# Altium schematic sheet GD32F450_External_Expansion(Camera)_V1.0.SchDoc
size A4
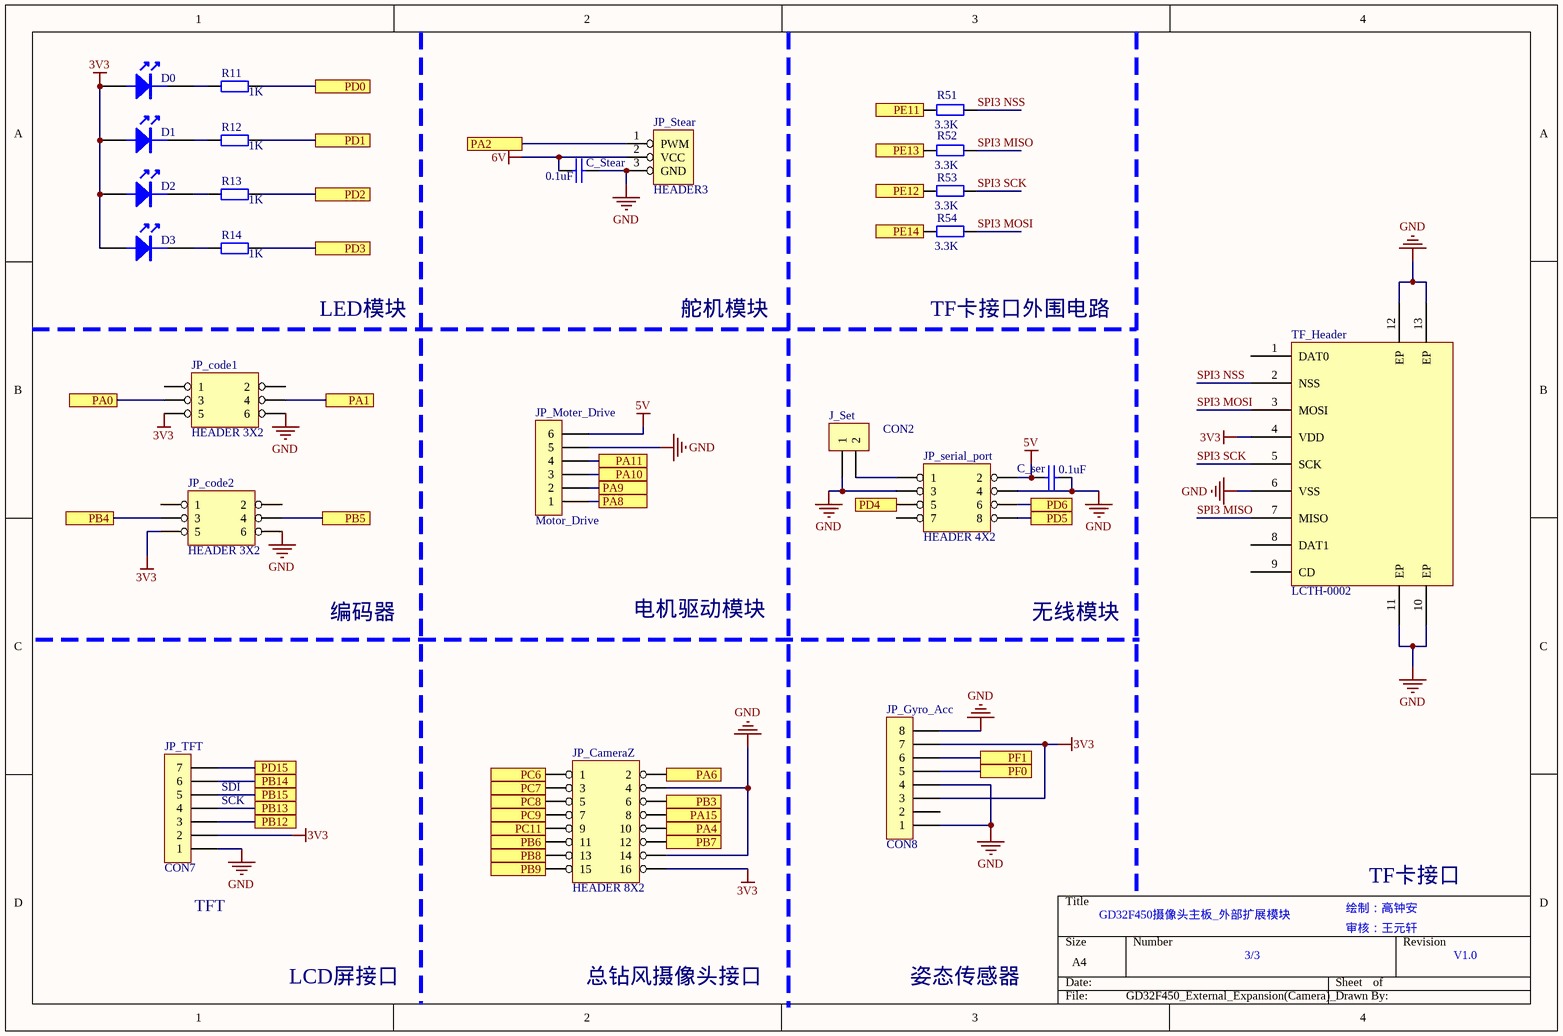
[diagram p0: GD32F450_External_Expansion(Camera)_V1.0.SchDoc]

## Parts
C_ser  0.1uF  [0805C]
C_Stear  0.1uF  [0805C]
D0  LED  [1206LED]  (value not drawn)
D1  LED  [1206LED]  (value not drawn)
D2  LED  [1206LED]  (value not drawn)
D3  LED  [1206LED]  (value not drawn)
J_Set  CON2  [SIP2]
JP_CameraZ  HEADER 8X2  [IDC16-JLC]
JP_code1  HEADER 3X2  [IDC6-JLC]
JP_code2  HEADER 3X2  [IDC6-JLC]
JP_Gyro_Acc  CON8  [SIP8]
JP_Moter_Drive  Motor_Drive  [SIP6N]
JP_serial_port  HEADER 4X2  [IDC8-JLC]
JP_Stear  HEADER3  [SIP3]
JP_TFT  CON7  [SIP7]
R11  value 1K  [0805R]  (hidden comment: Res2)
R12  value 1K  [0805R]  (hidden comment: Res2)
R13  value 1K  [0805R]  (hidden comment: Res2)
R14  value 1K  [0805R]  (hidden comment: Res2)
R51  value 3.3K  [0805R]
R52  value 3.3K  [0805R]
R53  value 3.3K  [0805R]
R54  value 3.3K  [0805R]
TF_Header  LCTH-0002  [TF_2]

## Ports
PA0, PA1, PA2, PA4, PA6, PA8, PA9, PA10, PA11, PA15, PB3, PB4, PB5, PB6, PB7, PB8, PB9, PB12, PB13, PB14, PB15, PC6, PC7, PC8, PC9, PC11, PD0, PD1, PD2, PD3, PD4, PD5, PD6, PD15, PE11, PE12, PE13, PE14, PF0, PF1

## Nets
3V3: D0.A D1.A D2.A D3.A JP_CameraZ.16 JP_code1.5 JP_code2.5 JP_Gyro_Acc.3 JP_Gyro_Acc.7 JP_TFT.2 TF_Header.4(VDD)
5V: C_ser.1 JP_Moter_Drive.6 JP_serial_port.2
6V: C_Stear.1 JP_Stear.2(VCC)
GND: C_ser.2 C_Stear.2 J_Set.1 JP_CameraZ.4 JP_CameraZ.14 JP_code1.6 JP_code2.6 JP_Gyro_Acc.1 JP_Gyro_Acc.4 JP_Gyro_Acc.8 JP_Moter_Drive.5 JP_serial_port.3 JP_serial_port.4 JP_Stear.3(GND) JP_TFT.1 TF_Header.6(VSS) TF_Header.10(EP) TF_Header.11(EP) TF_Header.12(EP) TF_Header.13(EP)
PA0: JP_code1.3 ; port PA0
PA1: JP_code1.4 ; port PA1
PA2: JP_Stear.1(PWM) ; port PA2
PA4: JP_CameraZ.10 ; port PA4
PA6: JP_CameraZ.2 ; port PA6
PA8: JP_Moter_Drive.1 ; port PA8
PA9: JP_Moter_Drive.2 ; port PA9
PA10: JP_Moter_Drive.3 ; port PA10
PA11: JP_Moter_Drive.4 ; port PA11
PA15: JP_CameraZ.8 ; port PA15
PB3: JP_CameraZ.6 ; port PB3
PB4: JP_code2.3 ; port PB4
PB5: JP_code2.4 ; port PB5
PB6: JP_CameraZ.11 ; port PB6
PB7: JP_CameraZ.12 ; port PB7
PB8: JP_CameraZ.13 ; port PB8
PB9: JP_CameraZ.15 ; port PB9
PB12: JP_TFT.3 ; port PB12
PB13: JP_TFT.4 ; port PB13
PB14: JP_TFT.6 ; port PB14
PB15: JP_TFT.5 ; port PB15
PC6: JP_CameraZ.1 ; port PC6
PC7: JP_CameraZ.3 ; port PC7
PC8: JP_CameraZ.5 ; port PC8
PC9: JP_CameraZ.7 ; port PC9
PC11: JP_CameraZ.9 ; port PC11
PD0: R11.2 ; port PD0
PD1: R12.2 ; port PD1
PD2: R13.2 ; port PD2
PD3: R14.2 ; port PD3
PD4: JP_serial_port.5 ; port PD4
PD5: JP_serial_port.8 ; port PD5
PD6: JP_serial_port.6 ; port PD6
PD15: JP_TFT.7 ; port PD15
PE11: R51.1 ; port PE11
PE12: R53.1 ; port PE12
PE13: R52.1 ; port PE13
PE14: R54.1 ; port PE14
PF0: JP_Gyro_Acc.5 ; port PF0
PF1: JP_Gyro_Acc.6 ; port PF1
SPI3 MISO: R52.2 TF_Header.7(MISO)
SPI3 MOSI: R54.2 TF_Header.3(MOSI)
SPI3 NSS: R51.2 TF_Header.2(NSS)
SPI3 SCK: R53.2 TF_Header.5(SCK)
NetD0_K: D0.K R11.1
NetD1_K: D1.K R12.1
NetD2_K: D2.K R13.1
NetD3_K: D3.K R14.1
NetJ_Set_2: J_Set.2 JP_serial_port.1

Not connected (* = marked no-connect by the designer): JP_code1 1 2; JP_code2 1 2; JP_Gyro_Acc 2; JP_serial_port 7; TF_Header 1(DAT0) 8(DAT1) 9(CD)

## Notes on the sheet
- LED模块
- 舵机模块
- TF卡接口外围电路
- 编码器
- 电机驱动模块
- 无线模块
- (near JP_TFT) SDI
- (near JP_TFT) SCK
- (near JP_TFT) TFT
- GD32F450摄像头主板_外部扩展模块
- 绘制：高钟安
- TF卡接口
- LCD屏接口
- 总钻风摄像头接口
- 姿态传感器
- 3/3
- 审核：王元轩
- V1.0

## Library data of the parts
C_ser C_Stear = CAP: Capacitor
J_Set = CON2: Connector
JP_Gyro_Acc = CON8: Connector
JP_Moter_Drive = CON6: Connector
JP_Stear = STEER
JP_TFT = CON7: Connector
R11-R14 R51-R54 = Res2: Resistor; Published: 8-Jun-2000; LatestRevisionDate: 17-Jul-2002; LatestRevisionNote: Re-released for DXP Platform.; PackageReference: AXIAL-0.4; Publisher: Altium Limited
  R51-R54: PackageDescription: Axial Device, Thru-Hole; 2 Leads; 0.4 in Pin Spacing
TF_Header = Component_2